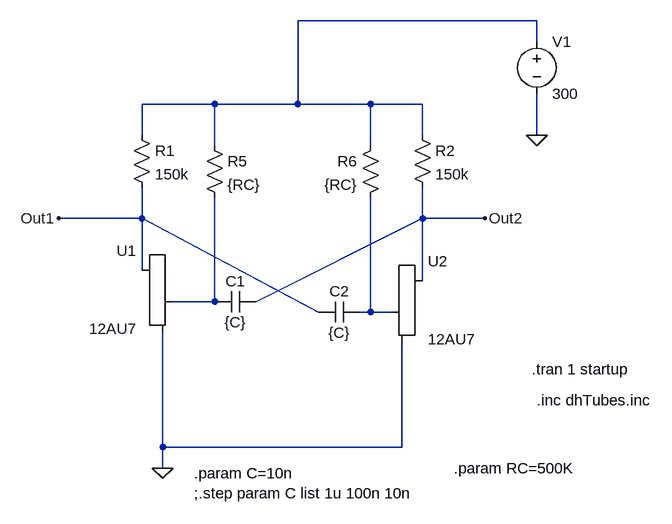
[diagram p0: schematic Astable-ECC82-2.asc]
Astable-ECC82-2.asc, the LTspice schematic file:
Version 4
SHEET 1 892 680
WIRE 704 -272 336 -272
WIRE 704 -240 704 -272
WIRE 208 -144 96 -144
WIRE 336 -144 336 -272
WIRE 336 -144 208 -144
WIRE 448 -144 336 -144
WIRE 528 -144 448 -144
WIRE 96 -96 96 -144
WIRE 528 -96 528 -144
WIRE 704 -96 704 -160
WIRE 208 -80 208 -144
WIRE 448 -80 448 -144
WIRE 96 32 96 -16
WIRE 96 32 -32 32
WIRE 528 32 528 -16
WIRE 624 32 528 32
WIRE 96 112 96 32
WIRE 528 128 528 32
WIRE 208 160 208 0
WIRE 208 160 144 160
WIRE 272 160 528 32
WIRE 368 176 96 32
WIRE 448 176 448 0
WIRE 448 176 432 176
WIRE 480 176 448 176
WIRE 128 384 128 208
WIRE 496 384 496 224
WIRE 496 384 128 384
WIRE 128 416 128 384
FLAG 128 416 0
FLAG 704 -96 0
FLAG -32 32 Out1
FLAG 624 32 Out2
SYMBOL Misc\\triode 96 160 M0
SYMATTR InstName U1
SYMATTR Value 12AU7
SYMATTR SpiceModel 12AU7
SYMBOL Misc\\triode 528 176 R0
SYMATTR InstName U2
SYMATTR Value 12AU7
SYMATTR SpiceModel 12AU7
SYMBOL voltage 704 -256 R0
WINDOW 123 0 0 Left 0
WINDOW 39 0 0 Left 0
SYMATTR InstName V1
SYMATTR Value 300
SYMBOL res 80 -112 R0
SYMATTR InstName R1
SYMATTR Value 150k
SYMBOL res 512 -112 R0
SYMATTR InstName R2
SYMATTR Value 150k
SYMBOL cap 272 144 R90
WINDOW 0 0 32 VBottom 2
WINDOW 3 32 32 VTop 2
SYMATTR InstName C1
SYMATTR Value {C}
SYMBOL cap 432 160 R90
WINDOW 0 0 32 VBottom 2
WINDOW 3 32 32 VTop 2
SYMATTR InstName C2
SYMATTR Value {C}
SYMBOL res 192 -96 R0
SYMATTR InstName R5
SYMATTR Value {RC}
SYMBOL res 464 -96 M0
SYMATTR InstName R6
SYMATTR Value {RC}
TEXT 704 312 Left 2 !.inc dhTubes.inc
TEXT 696 264 Left 2 !.tran 1 startup
TEXT 176 424 Left 2 !.param C=10n\n;.step param C list 1u 100n 10n
TEXT 576 416 Left 2 !.param RC=500K

The netlist it stands for:
* Astable-ECC82-2.asc
XU1 Out1 N002 0 12AU7 12AU7
XU2 Out2 N003 0 12AU7 12AU7
V1 N001 0 300
R1 N001 Out1 150k
R2 N001 Out2 150k
C1 Out2 N002 {C}
C2 N003 Out1 {C}
R5 N001 N002 {RC}
R6 N001 N003 {RC}
.inc dhTubes.inc
.tran 1 startup
.param C=10n
;.step param C list 1u 100n 10n
.param RC=500K
.backanno
.end